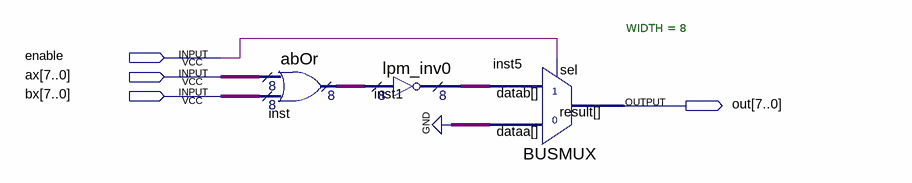
[diagram p0: schematic sheet]
// Quartus schematic ALU_NOR.bdf as structural Verilog: 3 symbols, 4 pins
module ALU_NOR (
  input  enable,
  input  [7:0] ax,
  input  [7:0] bx,
  output [7:0] out
);

  wire [7:0] inst1_result, inst_result;

  abOr inst (.data0x(ax), .data1x(bx), .result(inst_result));
  lpm_inv0 inst1 (.data(inst_result), .result(inst1_result));
  BUSMUX #(.WIDTH(8)) inst5 (.datab(inst1_result), .sel(enable), .dataa({8{1'b0}}), .result(out));
endmodule
